# Altium schematic sheet МИЭМ.467999.001Э3(2).SchDoc
size 420 x 297 mm; SheetNumber: 2; SheetTotal: 4; DecimalNumber: МИЭМ.467999.001Э3
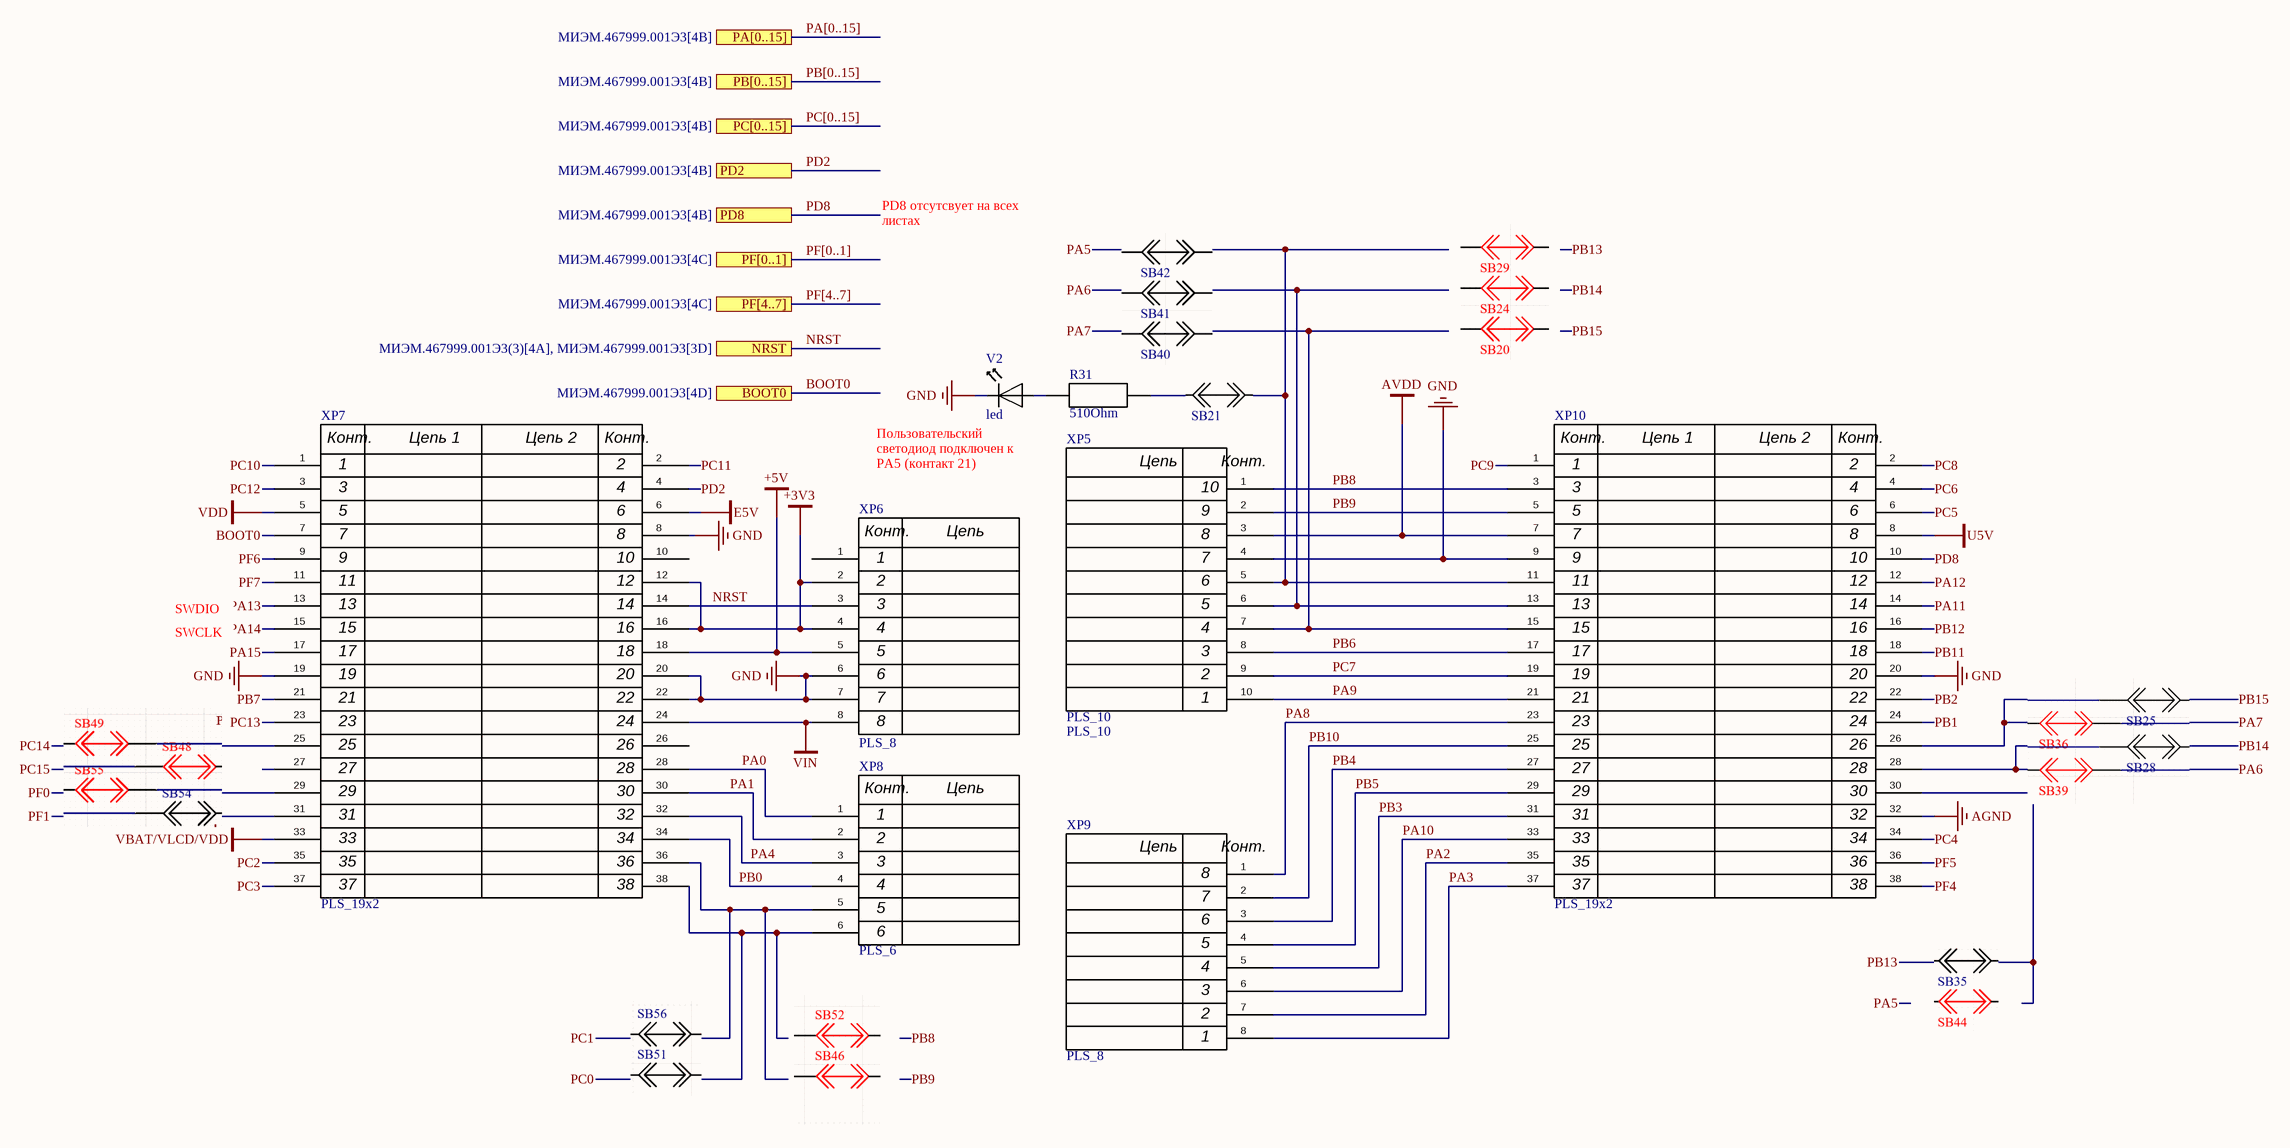
[diagram p0: МИЭМ.467999.001Э3(2).SchDoc]

## Parts
R31  510Ohm  [0603]
V2  led  [FYLS-0603PGC]
XP5  PLS_10  [PLS_10]
XP6  PLS_8  [PLS_8]
XP7  PLS_19x2  [PLS_19x2]
XP8  PLS_6  [PLS_6]
XP9  PLS_8  [PLS_8]
XP10  PLS_19x2  [PLS_19x2]

## Ports
BOOT0 (see МИЭМ.467999.001Э3[4D]), NRST (see МИЭМ.467999.001Э3(3)[4A], МИЭМ.467999.001Э3[3D]), PA[0..15] (see МИЭМ.467999.001Э3[4B]), PB[0..15] (see МИЭМ.467999.001Э3[4B]), PC[0..15] (see МИЭМ.467999.001Э3[4B]), PD2 (see МИЭМ.467999.001Э3[4B]), PD8 (see МИЭМ.467999.001Э3[4B]), PF[0..1] (see МИЭМ.467999.001Э3[4C]), PF[4..7] (see МИЭМ.467999.001Э3[4C])

## Nets
+3V3: XP6.2 XP6.4 XP7.12 XP7.16
+5V: XP6.5 XP7.18
AGND: XP10.32
AVDD: XP5.3 XP10.7
E5V: XP7.6
GND: V2.2 XP5.4 XP6.6 XP6.7 XP7.8 XP7.19 XP7.20 XP7.22 XP10.9 XP10.20
U5V: XP10.8
VBAT/VLCD/VDD: XP7.33
VDD: XP7.5
VIN: XP6.8 XP7.24
BOOT0: XP7.7 ; port BOOT0
NRST: XP6.3 XP7.14 ; port NRST
PA0: XP7.28 XP8.1
PA1: XP7.30 XP8.2
PA2: XP9.7 XP10.35
PA3: XP9.8 XP10.37
PA4: XP7.32 XP8.3
PA5: R31.2 XP5.5 XP10.11
PA6: XP5.6 XP10.13
PA7: XP5.7 XP10.15
PA8: XP9.1 XP10.23
PA9: XP5.10 XP10.21
PA10: XP9.6 XP10.33
PA11: XP10.14
PA12: XP10.12
PA13: XP7.13
PA14: XP7.15
PA15: XP7.17
PB0: XP7.34 XP8.4
PB1: XP10.24
PB2: XP10.22
PB3: XP9.5 XP10.31
PB4: XP9.3 XP10.27
PB5: XP9.4 XP10.29
PB6: XP5.8 XP10.17
PB7: XP7.21
PB8: XP5.1 XP10.3
PB9: XP5.2 XP10.5
PB10: XP9.2 XP10.25
PB11: XP10.18
PB12: XP10.16
PB13: XP10.30
PB14: XP10.28
PB15: XP10.26
PC0: XP7.38 XP8.6
PC1: XP7.36 XP8.5
PC2: XP7.35
PC3: XP7.37
PC4: XP10.34
PC5: XP10.6
PC6: XP10.4
PC7: XP5.9 XP10.19
PC8: XP10.2
PC9: XP10.1
PC10: XP7.1
PC11: XP7.2
PC12: XP7.3
PC13: XP7.23
PD2: XP7.4 ; port PD2
PD8: XP10.10 ; port PD8
PF1: XP7.31
PF4: XP10.38
PF5: XP10.36
PF6: XP7.9
PF7: XP7.11
NetR31_1: R31.1 V2.1

Not connected (* = marked no-connect by the designer): XP6 1; XP7 10 25 26 27 29

## Buses and harness runs
bus PA[0..15] = port PA[0..15]
bus PB[0..15] = port PB[0..15]
bus PC[0..15] = port PC[0..15]
bus PF[0..1] = port PF[0..1]
bus PF[4..7] = port PF[4..7]

## Notes on the sheet
- PD8 отсутсвует на всех листах
- Пользовательский светодиод подключен к PA5 (контакт 21)
- (near XP5) 8
- (near XP5) 10
- (near XP5) 9
- SWDIO
- (near XP6) 1
- (near XP6) 2
- (near XP6) 3
- (near XP5) 7
- (near XP5) 6
- (near XP5) 5
- SWCLK
- (near XP6) 4
- (near XP6) 5
- (near XP6) 6
- (near XP6) 7
- (near XP5) 4
- (near XP5) 3
- (near XP5) 2
- (near XP5) 1
- (near XP6) 8
- (near XP8) 1
- (near XP8) 2
- (near XP8) 3
- (near XP8) 4
- (near XP8) 5
- (near XP9) 8
- (near XP9) 7
- (near XP9) 6
- (near XP8) 6
- (near XP9) 5
- (near XP9) 4
- (near XP9) 3
- (near XP9) 2
- (near XP9) 1
- Подп. и дата
- Инв.№ дубл.
- Взам.инв.№
- Подп.и дата
- Инв.№ подл.
- Изм.
- Лист
- № докум.
- Подп.
- Дата
- Формат  A3
- (in symbol PLS_6) Конт.; Цепь
- (in symbol PLS_8) Конт.; Цепь
- (in symbol PLS_10) Цепь; Конт.
- (in symbol PLS_19x2) Конт.; Цепь 1; Цепь 2

## Library data of the parts
R31 = Resistor: PartNumber: RC0603FR-07510RL; VCC: 50В; Power: 0.063Вт; Ta: 155°C; Tolerance: 1%; Value: 510Ohm; Package: 0603; Manufacturer: *; ComponentLink1Description: Datasheet; ComponentLink1URL: *; ComponentLink2Description: Source; ComponentLink2URL: https://www.chipdip.ru/product/0.1vt-0603-510-om-1-chip-rezistor-smd-9000079669
V2 = led: Manufacturer: Ningbo Foryard Optoelectronics; Desc: Диод светоизлучающий; PartNumber: FYLS-0603PGC; Package: 0603; Color: Зеленый; ComponentLink1Description: Source; ComponentLink1URL: https://www.chipdip.ru/product/fyls-0603pgc-svetodiod-smd-1-6x0-8mm-zelenyy-525nm-foryard-9000204615; Ta: *
XP5 = PLS_10: Desc: Соединение контактное; PartNumber: PLS_10
XP6 XP9 = PLS_8: Desc: Соединение контактное; PartNumber: PLS_8
XP7 XP10 = PLS_19x2: Desc: Соединение контактное; PartNumber: PLS_19x2; ComponentLink1Description: Source; ComponentLink1URL: *
XP8 = PLS_6: Desc: Соединение контактное; PartNumber: PLS_6